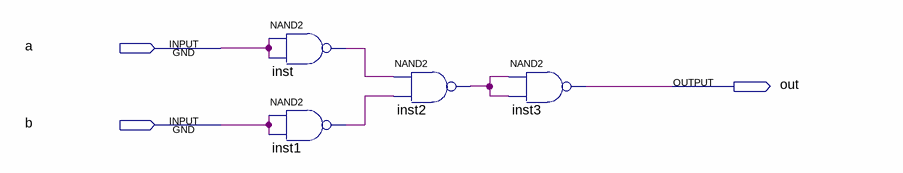
[diagram p0: schematic sheet]
// Quartus schematic Nor-primitive.bdf as structural Verilog: 4 symbols, 3 pins
module \Nor-primitive  (
  input  a,
  input  b,
  output out
);

  wire inst1_out, inst2_out, inst_out;

  nand inst (inst_out, a, a);
  nand inst1 (inst1_out, b, b);
  nand inst2 (inst2_out, inst_out, inst1_out);
  nand inst3 (out, inst2_out, inst2_out);
endmodule
